# Altium schematic sheet LOKI-PSS-V1-r3.0.SchDoc
size A; SheetNumber: 1; SheetTotal: 1
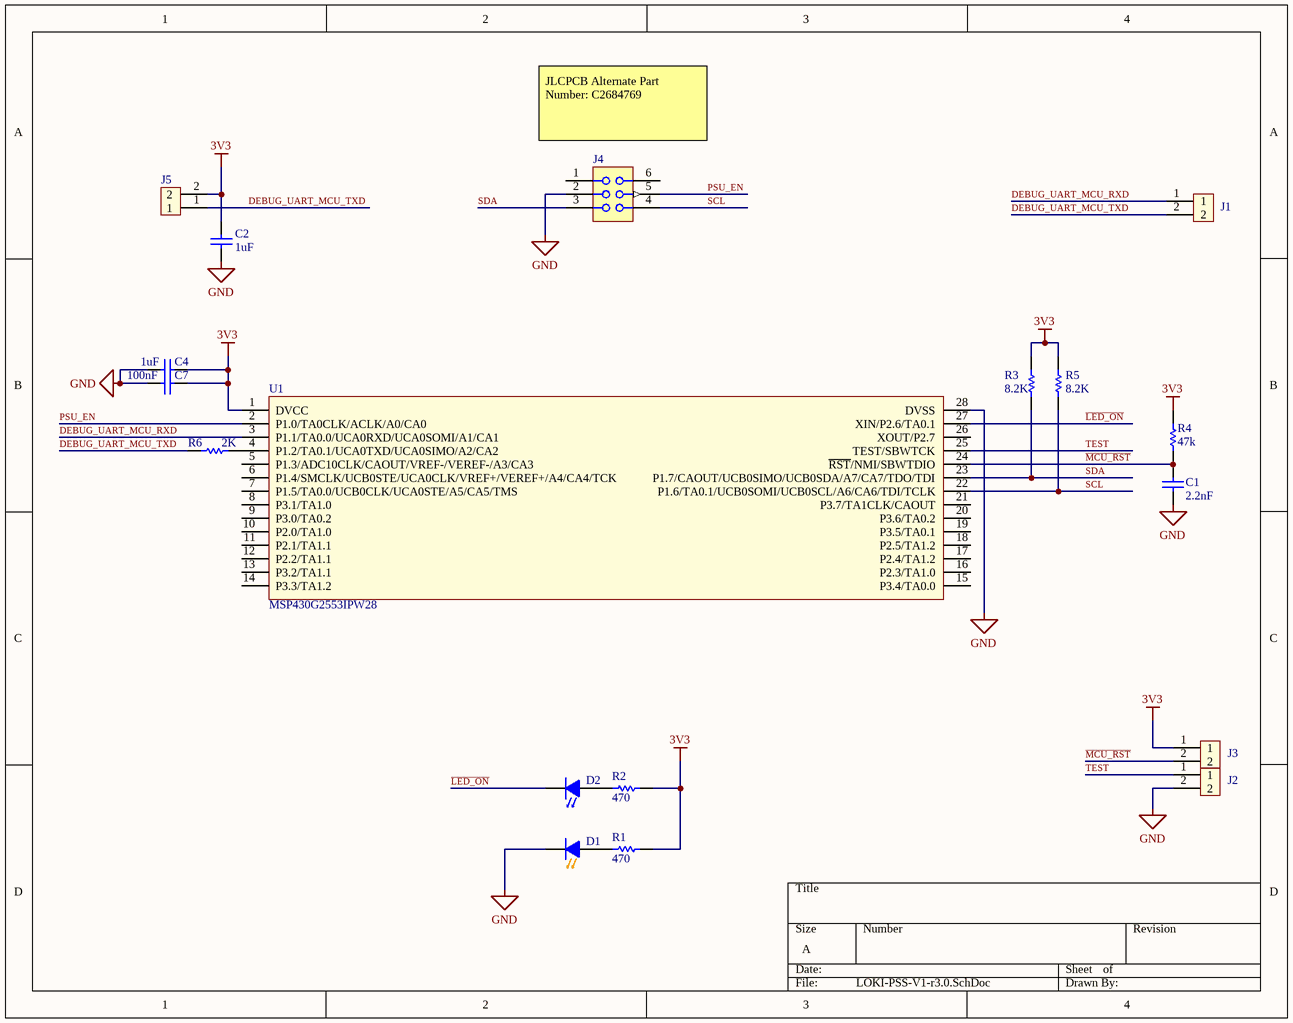
[diagram p0: LOKI-PSS-V1-r3.0.SchDoc]

## Parts
C1  2.2nF  [C0402_BEI]
C2  1uF  [C0402_L]
C4  1uF  [C0402_L]
C7  100nF  [C0402_BEI]
D1  LED-ORANGE  [LED0603_L_ORANGE]  (value not drawn)
D2  LED-BLUE  [LED0603_L_BLUE]  (value not drawn)
J1  Header_2POS  [H2_2.54mm_S_THOLE]  (value not drawn)  (no BOM)
J2  Header_2POS  [H2_2.54mm_S_THOLE]  (value not drawn)  (no BOM)
J3  Header_2POS  [H2_2.54mm_S_THOLE]  (value not drawn)  (no BOM)
J4  2x3 Connector  [BF100-06-X-X-1-0640]  (value not drawn)
J5  Header_2POS  [2POS_RA_TH]  (value not drawn)
R1  470  [R0402_L]
R2  470  [R0402_L]
R3  8.2K  [R0402_L]
R4  47k  [R0402_BEI]
R5  8.2K  [R0402_L]
R6  2K  [R0402_L]
U1  MSP430G2553IPW28  [28-TSSOP_L]

## Nets
3V3: C2.2 C4.2 C7.2 J3.1 J5.2 R1.2 R2.2 R3.2 R4.2 R5.2 U1.1(DVCC)
GND: C1.1 C2.1 C4.1 C7.1 D1.2(K) J2.2 J4.2 U1.28(DVSS)
DEBUG_UART_MCU_RXD: J1.1 U1.3(P1.1/TA0.0/UCA0RXD/UCA0SOMI/A1/CA1)
DEBUG_UART_MCU_TXD: J1.2 J5.1 R6.1
~{LED_ON}: D2.2(K) U1.27(XIN/P2.6/TA0.1)
~{MCU_RST}: C1.2 J3.2 R4.1 U1.24(~{RST}/NMI/SBWTDIO)
PSU_EN: J4.5 U1.2(P1.0/TA0CLK/ACLK/A0/CA0)
SCL: J4.4 R5.1 U1.22(P1.6/TA0.1/UCB0SOMI/UCB0SCL/A6/CA6/TDI/TCLK)
SDA: J4.3 R3.1 U1.23(P1.7/CAOUT/UCB0SIMO/UCB0SDA/A7/CA7/TDO/TDI)
TEST: J2.1 U1.25(TEST/SBWTCK)
NetD1_1: D1.1(A) R1.1
NetD2_1: D2.1(A) R2.1
NetR6_2: R6.2 U1.4(P1.2/TA0.1/UCA0TXD/UCA0SIMO/A2/CA2)

Not connected (* = marked no-connect by the designer): J4 1 6; U1 5(P1.3/ADC10CLK/CAOUT/VREF-/VEREF-/A3/CA3) 6(P1.4/SMCLK/UCB0STE/UCA0CLK/VREF+/VEREF+/A4/CA4/TCK) 7(P1.5/TA0.0/UCB0CLK/UCA0STE/A5/CA5/TMS) 8(P3.1/TA1.0) 9(P3.0/TA0.2) 10(P2.0/TA1.0) 11(P2.1/TA1.1) 12(P2.2/TA1.1) 13(P3.2/TA1.1) 14(P3.3/TA1.2) 15(P3.4/TA0.0) 16(P2.3/TA1.0) 17(P2.4/TA1.2) 18(P2.5/TA1.2) 19(P3.5/TA0.1) 20(P3.6/TA0.2) 21(P3.7/TA1CLK/CAOUT) 26(XOUT/P2.7)

## Notes on the sheet
- (near J4) JLCPCB Alternate Part Number: C2684769

## Library data of the parts
C1 = GRM155R71H222KA01D (2): CAP CER 2200PF 50V 10% X7R 0402; Manufacturer: Murata Electronics North America; Part Number: GRM155R71H222KA01D (2); Supplier 1: Digi-Key; Supplier Part Number 1: 490-1305-1-ND; Manufacturer Part Number: GRM155R71H222KA01D; Category: Capacitors; Capacitance: 2.2nF; Voltage - Rated: 50V; Tolerance: ±10%; Temperature Coefficient: X7R; Mounting Type: Surface Mount, MLCC; Operating Temperature: -55°C ~ 125°C; Applications: General Purpose; Package / Case: 0402 (1005 Metric); Size / Dimension: 0.039" L x 0.020" W (1.00mm x 0.50mm); Thickness: 0.022" (0.55mm); Packaging: Cut Tape (CT)
C2 C4 = JMK105BJ105KV-F: CAP CER 1UF 6.3V X5R 0402; Manufacturer: Taiyo Yuden; Tolerance: ±10%; Part Number: JMK105BJ105KV-F; Supplier 1: Digi-Key; Supplier Part Number 1: 587-1231-1-ND; Manufacturer Part Number: JMK105BJ105KV-F; RoHS: RoHS Compliant; Category: Capacitors; Stock 1: 0; Pricing 1: 1=0.1, 10=0.013, 100=0.0056, 500=0.004, 1000=0.00315, 2500=0.00286, 5000=0.00263 (USD); Capacitance: 1uF; Voltage - Rated: 6.3V; Temperature Coefficient: X5R; Mounting Type: Surface Mount, MLCC; Operating Temperature: -55°C ~ 85°C; Applications: General Purpose; Ratings: -; Package / Case: 0402 (1005 Metric); Size / Dimension: 0.039" L x 0.020" W (1.00mm x 0.50mm); Lead Spacing: -; Features: -; Packaging: Cut Tape (CT); Lead Style: -; ComponentLink1URL: http://ds.yuden.co.jp/TYCOMPAS/ut/detail.do?productNo=JMK105BJ105KV-F&fileName=JMK105BJ105KV-F_SS&mode=specSheetDownload; ComponentLink1Description: http://ds.yuden.co.jp/TYCOMPAS/ut/detail.do?productNo=JMK105BJ105KV-F&fileName=JMK105BJ105KV-F_SS&mode=specSheetDownload; Height - Seated (Max): -; Thickness (Max): 0.022" (0.55mm); Part Status: Active
C7 = C1005X5R1A104K050BA: CAP CER 0.1UF 10V X5R 0402; Owlet Part Number: E0072; Manufacturer: TDK Corporation; Tolerance: ±10%; Notification: Current market demand for these product types have resulted in fluctuating and extending lead times. Lead times may differ.; Part Number: C1005X5R1A104K050BA; Supplier 1: Digi-Key; Supplier Part Number 1: 445-1265-2-ND; Manufacturer Part Number: C1005X5R1A104K050BA; RoHS: RoHS Compliant; Category: Capacitors; Stock 1: 2060000; Pricing 1: 10000=0.00785, 20000=0.00748, 30000=0.00711 (USD); Capacitance: 100nF; Voltage - Rated: 10V; Temperature Coefficient: X5R; Mounting Type: Surface Mount, MLCC; Operating Temperature: -55°C ~ 85°C; Applications: General Purpose; Ratings: -; Package / Case: 0402 (1005 Metric); Size / Dimension: 0.039" L x 0.020" W (1.00mm x 0.50mm); Lead Spacing: -; Features: Low ESL; Packaging: Tape & Reel (TR); Lead Style: -; ComponentLink1URL: https://product.tdk.com/info/en/catalog/datasheets/mlcc_commercial_general_en.pdf; ComponentLink1Description: https://product.tdk.com/info/en/catalog/datasheets/mlcc_commercial_general_en.pdf; Height - Seated (Max): -; Thickness (Max): 0.022" (0.55mm); Part Status: Not For New Designs; Failure Rate: -
D1 = B1931UD--05D000314U1930: Led Orange Clear 1608 SMD; Manufacturer: Inolux; Part Number: B1931UD--05D000314U1930; Supplier 1: Digi-Key; Supplier Part Number 1: 3147-B1931UD--05D000314U1930CT-ND; Manufacturer Part Number: B1931UD--05D000314U1930; RoHS: No
D2 = LTST-C191TBKT: Single Color LED, Ultra Bright Blue, Water Clear, 1.1mm; Manufacturer: Vishay Lite-On; Viewing Angle: 130°; Forward Current: 20mA; Forward Voltage: 3.8V; Shape: Rectangular; Luminous Intensity-Nom: 104mcd; Channels: 1; Reverse Voltage-Max: 5V; Luminous Intensity-Min: 130cd; Overall Height: 0.55mm; Part Number: LTST-C191TBKT; ComponentLink1Description: https://datasheet.ciiva.com:443/pdfs/VipMasterIC/IC/LITE/LITE-S-A0009182577/LITE-S-A0009182577-1.pdf?src-supplier=IHS+Markit; ComponentLink1URL: https://datasheet.ciiva.com:443/pdfs/VipMasterIC/IC/LITE/LITE-S-A0009182577/LITE-S-A0009182577-1.pdf?src-supplier=IHS+Markit; ComponentLink2Description: https://datasheet.ciiva.com/2110/ltst-c191tbkt-2110256.pdf?src-supplier=Digi-Key; ComponentLink2URL: https://datasheet.ciiva.com/2110/ltst-c191tbkt-2110256.pdf?src-supplier=Digi-Key; Supplier 1: Arrow Electronics; Supplier Part Number 1: LTST-C191TBKT; Manufacturer Part Number: LTST-C191TBKT; RoHS: Yes; Category: LEDs; Stock 1: 3644; Pricing 1: 1=0.32580, 10=0.28310, 25=0.24740, 100=0.16540, 250=0.11260, 500=0.11150, 1000=0.08270, 3000=0.08190 (USD); Packaging: Tape and Reel; Color: Blue; ComponentLink3URL: https://datasheet.ciiva.com/19465/2047945-19465673.pdf?src-supplier=Jameco; ComponentLink3Description: https://datasheet.ciiva.com/19465/2047945-19465673.pdf?src-supplier=Jameco; Min Operating Temperature: -20°C; Max Operating Temperature: 80°C; ComponentLink4URL: https://datasheet.ciiva.com/11774/0900766b80dc02b4-11774413.pdf?src-supplier=RSComponents; ComponentLink4Description: https://datasheet.ciiva.com/11774/0900766b80dc02b4-11774413.pdf?src-supplier=RSComponents; RoHS Compliant: Yes; Pins: 2; Terminal Finish: Tin; JESD-609 Code: e3; Mounting Technology: Surface Mount; Color@wavelength: Blue; Optoelectronic Device Type: SINGLE COLOR LED; Lens Style: WATER CLEAR; Size: 1.1mm; Terminal Pitch: 1.5mm; Reach SVHC Compliant: Yes
J1-J3 = TSW-106-08-L-S-R: Conn Unshrouded Header HDR 2 POS 2.54mm Solder S Thru-Hole; Part Number: TSW-106-08-L-S-R
J4 = BF100-06-A-D-0-0640-L-C: 6POS, 2MM PITCH SOCKET, DIL, SMT; Part Number: BF100-06-A-D-0-0640-L-C
J5 = PH1RB-02-UA: Conn Unshrouded Header HDR 2 POS 2.54mm Solder RA Thru-Hole; Manufacturer: Adam Equipment; Part Number: PH1RB-02-UA; Supplier 1: Digi-Key; Supplier Part Number 1: 2057-PH1RB-02-UA-ND; Manufacturer Part Number: PH1RB-02-UA; RoHS: No; Stock 1: 23642; Pricing 1: 1=0.10000, 10=0.06500, 100=0.04830, 500=0.04000, 1000=0.03500, 5000=0.03000, 10000=0.02916 (USD); Category: Connectors
R1 R2 = ERJ-2RKF4700X: RES 470 OHM 1/10W 1% 0402 SMD; Manufacturer: Panasonic - ECG; Temperature Coefficient: ±100ppm/°C; Power (Watts): 0.1W, 1/10W; Part Number: ERJ-2RKF4700X; Supplier 1: Digi-Key; Supplier Part Number 1: P470LCT-ND; Manufacturer Part Number: ERJ-2RKF4700X; RoHS: RoHS Compliant; Category: Resistors; Stock 1: 363974; Pricing 1: 1=0.06, 50=0.0242, 100=0.0184, 250=0.01364, 500=0.01008, 1000=0.00672, 5000=0.00473 (USD); Tolerance: ±1%; Package / Case: 0402 (1005 Metric); Size / Dimension: 0.039" L x 0.020" W (1.00mm x 0.50mm); Height: 0.016" (0.40mm); Features: -; Packaging: Cut Tape (CT); ComponentLink1URL: http://industrial.panasonic.com/www-cgi/jvcr13pz.cgi?E+PZ+3+AOA0002+ERJ2RKF4700X+7+WW; ComponentLink1Description: http://industrial.panasonic.com/www-cgi/jvcr13pz.cgi?E+PZ+3+AOA0002+ERJ2RKF4700X+7+WW; Resistance (Ohms): 470; Composition: Thick Film; Number of Terminations: 2
R3 R5 = ERJ-2RKF8201X: RES 8.20K OHM 1/10W 1% 0402 SMD; Manufacturer: Panasonic - ECG; Temperature Coefficient: ±100ppm/°C; Power (Watts): 0.1W, 1/10W; Part Number: ERJ-2RKF8201X; Supplier 1: Digi-Key; Supplier Part Number 1: P8.20KLCT-ND; Manufacturer Part Number: ERJ-2RKF8201X; RoHS: RoHS Compliant; Category: Resistors; Stock 1: 82374; Pricing 1: 1=0.06, 50=0.0242, 100=0.0184, 250=0.01364, 500=0.01008, 1000=0.00672, 5000=0.00473 (USD); Tolerance: ±1%; Package / Case: 0402 (1005 Metric); Size / Dimension: 0.039" L x 0.020" W (1.00mm x 0.50mm); Height: 0.016" (0.40mm); Features: -; Packaging: Cut Tape (CT); ComponentLink1URL: http://industrial.panasonic.com/www-cgi/jvcr13pz.cgi?E+PZ+3+AOA0002+ERJ2RKF8201X+7+WW; ComponentLink1Description: http://industrial.panasonic.com/www-cgi/jvcr13pz.cgi?E+PZ+3+AOA0002+ERJ2RKF8201X+7+WW; Resistance (Ohms): 8.2k; Composition: Thick Film; Number of Terminations: 2
R4 = ERJ-2GEJ473X (2): RES SMD 47K OHM 5% 1/10W 0402; Owlet Part Number: E0067; Manufacturer: Panasonic Electronic Components; Temperature Coefficient: ±200ppm/°C; Power (Watts): 0.1W, 1/10W; Resistance (Ohms): 47k; Part Number: ERJ-2GEJ473X (2); Supplier 1: Digi-Key; Supplier Part Number 1: P47KJCT-ND; Manufacturer Part Number: ERJ-2GEJ473X; RoHS: RoHS Compliant; Category: Resistors; Stock 1: 3897027; Pricing 1: 1=0.1, 10=0.026, 100=0.0107, 1000=0.00479, 2500=0.00416, 5000=0.00344 (USD); Tolerance: ±5%; Operating Temperature: -55°C ~ 155°C; Package / Case: 0402 (1005 Metric); Size / Dimension: 0.039" L x 0.020" W (1.00mm x 0.50mm); Features: Automotive AEC-Q200; Packaging: Cut Tape (CT); ComponentLink1URL: http://industrial.panasonic.com/www-cgi/jvcr13pz.cgi?E+PZ+3+AOA0001+ERJ2GEJ473X+7+WW; ComponentLink1Description: http://industrial.panasonic.com/www-cgi/jvcr13pz.cgi?E+PZ+3+AOA0001+ERJ2GEJ473X+7+WW; Composition: Thick Film; Supplier Device Package: 0402; Height - Seated (Max): 0.016" (0.40mm); Part Status: Active; Failure Rate: -
R6 = RC0402JR-072KL: RES 2.0K OHM 1/16W 5% 0402 SMD; Manufacturer: Yageo; Temperature Coefficient: ±100ppm/°C; Power (Watts): 0.063W, 1/16W; Part Number: RC0402JR-072KL; Supplier 1: Digi-Key; Supplier Part Number 1: 311-2.0KJRCT-ND; Manufacturer Part Number: RC0402JR-072KL; RoHS: RoHS Compliant; Category: Resistors; Stock 1: 88201; Pricing 1: 1=0.1, 10=0.013, 25=0.0092, 100=0.0053, 250=0.004, 500=0.0032, 1000=0.00236, 2500=0.00205, 5000=0.00169 (USD); Tolerance: ±5%; Package / Case: 0402 (1005 Metric); Size / Dimension: 0.039" L x 0.020" W (1.00mm x 0.50mm); Height: 0.016" (0.40mm); Features: -; Packaging: Cut Tape (CT); ComponentLink1URL: http://www.yageo.com/documents/recent/PYu-RC0402_51_RoHS_L_6.pdf; ComponentLink1Description: http://www.yageo.com/documents/recent/PYu-RC0402_51_RoHS_L_6.pdf; Resistance (Ohms): 2k; Composition: Thick Film; Number of Terminations: 2; Supplier Device Package: 0402
U1 = MSP430G2553IPW28R: MSP430 MSP430G2xx Microcontroller IC 16-Bit 16MHz 16KB (16K x 8) FLASH 28-TSSOP; Manufacturer: Texas Instruments; Part Number: MSP430G2553IPW28R; Supplier 1: Arrow Electronics; Supplier Part Number 1: MSP430G2553IPW28R; Manufacturer Part Number: MSP430G2553IPW28R; RoHS: Yes; Category: Microcontrollers; Stock 1: 2000; Pricing 1: 1=3.54200, 10=3.10160, 25=2.97160, 100=2.55990, 250=2.41040, 500=2.19190, 1000=1.98950 (USD)